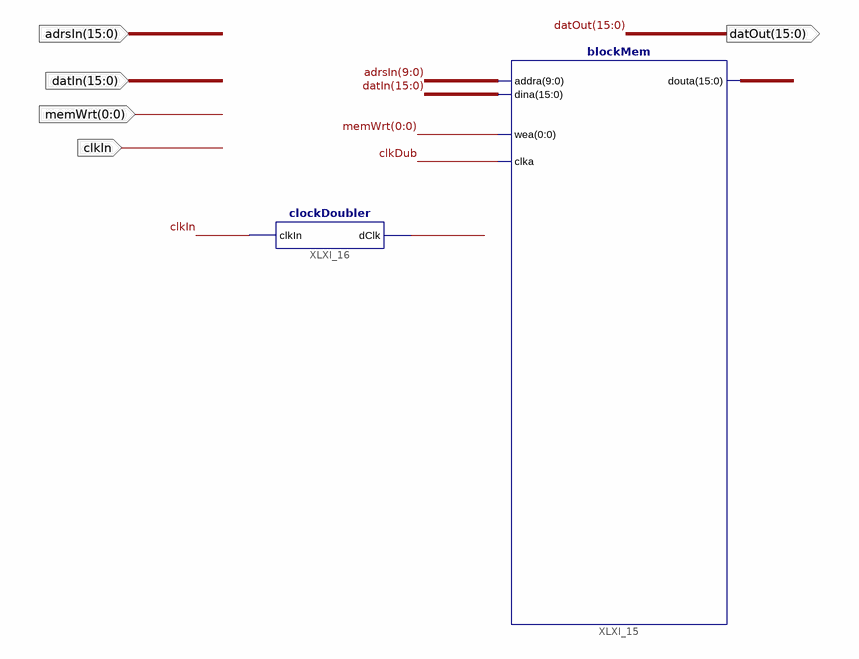
[diagram p0: schematic sheet 1]
// Xilinx ISE schematic customMem.sch (spartan3e) as structural Verilog: 2 symbols, 5 ports
module customMem (
  input  clkIn,
  input  [15:0] datIn,
  input  [15:0] adrsIn,
  input  [0:0] memWrt,
  output [15:0] datOut
);

  wire clkDub;

  clockDoubler XLXI_16 (.clkIn(clkIn), .dClk(clkDub));
  blockMem XLXI_15 (.addra(adrsIn[9:0]), .dina(datIn), .wea(memWrt[0]), .clka(clkDub), .douta(datOut));
endmodule
